# EAGLE design AudioPreAmp-LM741-TO99 (EAGLE 7.2.0)
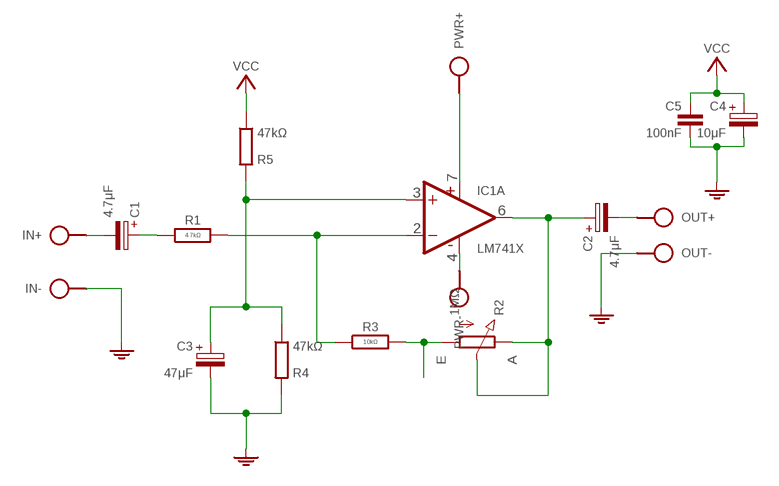
[diagram p0: schematic, sheet 1]

## Parts
C1  4.7μF  CPOLE2,5-4/V  [E2.5-4/V]
C2  4.7μF  CPOLE5-4  [E5-4]
C3  47μF  CPOLE2,5-4  [E2,5-4]
C4  10μF  CPOLE2,5-3  [E2,5-3]
C5  100nF  C050-020X044/V  [C050-020X044/V]
IC1  LM741X  [TO99-X]
IN  SPAD+--+  [SPAD-+]
OUT  SPAD+-+-  [SPAD+-]
PWR+  HPORT  [SPAD]
PWR-  HPORT  [SPAD]
R1  4.7kΩ  R-H0204/10  [0204/10]
R2  1MΩ  POT-3P  [CONN-3P]
R3  10kΩ  R-H0204/10-V  [0204/10-V]
R4  47kΩ  R0204/10-V  [0204/10-V]
R5  47kΩ  R0204/10  [0204/10]

## Nets
AF: C2.- OUT.2
GND: C3.- C4.- C5.2 IN.1 OUT.1 R4.1
IN+: C3.+ IC1.3(A:+IN) R4.2 R5.1
IN-: IC1.2(A:-IN) R1.2 R3.1
N$1: R2.1(A) R3.2
N$2: C1.+ R1.1
N$4: IC1.4(2:V-) PWR-.1
N$7: C1.- IN.2
N$8: C2.+ IC1.6(A:OUT) R2.2(S) R2.3(E)
PWR+: IC1.7(2:V+) PWR+.1
VCC: C4.+ C5.1 R5.2

## Library data of the parts
C1-C4 = c:CPOL: POLARIZED CAPACITOR, European symbol
C5 = c:C: CAPACITOR, European symbol
IC1 = ic:LM741: Operational Amplifier http://www.ti.com/lit/ds/symlink/lm741.pdf
IN OUT = pad:SPAD+-
PWR+ PWR- = pad:HPORT
R1 R3 = r:R-H
R2 = r:POT
R4 R5 = r:R: RESISTOR, European symbol

## Board
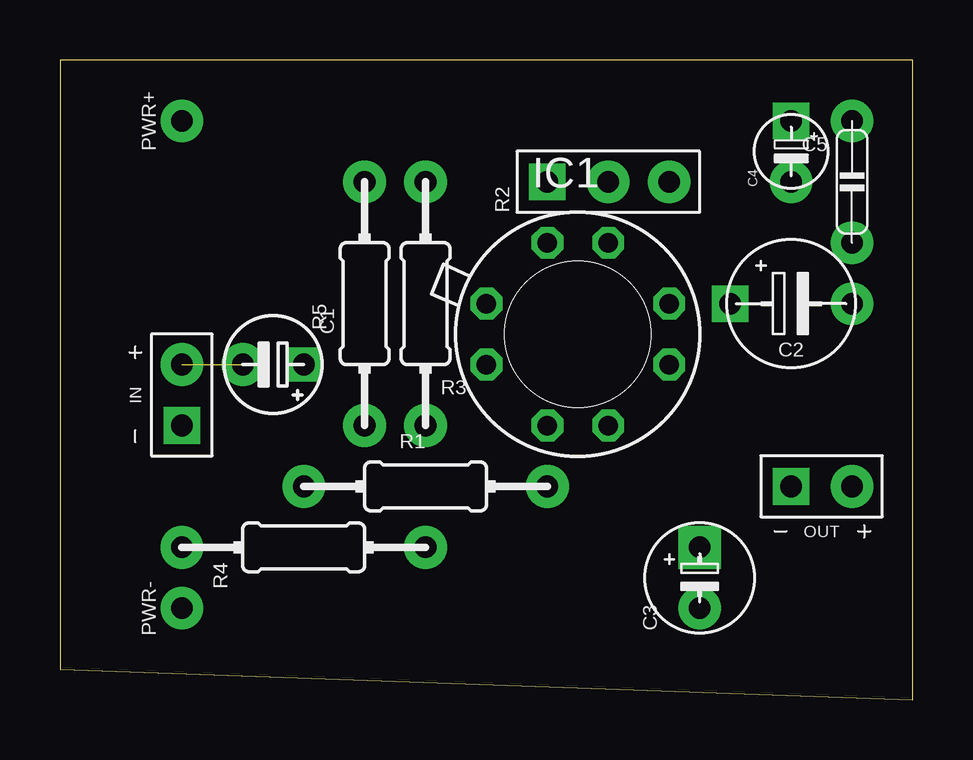
[diagram p1: board, top side]
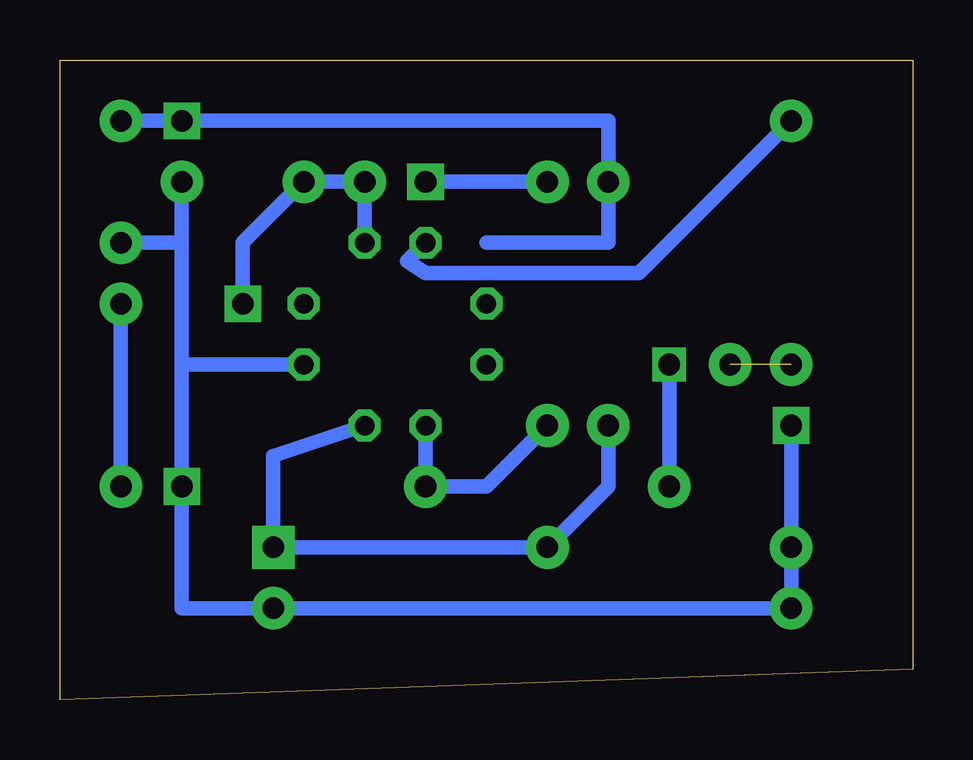
[diagram p2: board, bottom side, seen from below]

Size 35.56 x 26.67 mm. Coordinates in mm from the lower left corner, seen from the top.
Outline: 0,1.27 35.56,0 35.56,26.67 0,26.67 0,1.27
Copper layers (1*16): Top 0.035mm / dielectric 1.5mm / Bottom 0.035mm
Design rules "default": minimum track width 10mil, minimum drill 24mil, track to track 8mil, track to pad 8mil, pad to pad 8mil, via to via 8mil, smd to smd 8mil, copper to edge 40mil, drill to drill 8mil, minimum pad ring 10mil, minimum via ring 8mil, stop-mask expansion 4mil, vias tented up to drill 0mil, thermal gap 10mil

### Footprints (pad centres in the part's own frame; a part is rotated, then mirrored left to right if it is on the bottom)
E2.5-4/V = drill 0.9 square: + 0,1.27 | drill 0.9 pad 1.778: - 0,-1.27
E5-4 = drill 0.9 pad 1.524 square: + -2.54,0 | drill 0.9 pad 1.778: - 2.54,0
E2,5-4 = drill 0.9 pad 1.778 square: + 1.27,0 | drill 0.9 pad 1.778: - -1.27,0
E2,5-3 = drill 0.9 pad 1.524 square: + -1.27,0 | drill 0.9 pad 1.778: - 1.27,0
C050-020X044/V = drill 0.9 pad 1.778: 1 0,2.54; 2 0,-2.54
TO99-X = drill 0.813 pad 1.27 octagon: 1 -2.54,0; 2 0,-2.54; 3 2.54,-2.54; 4 5.08,0; 5 5.08,2.54; 6 2.54,5.08; 7 0,5.08; 8 -2.54,2.54
SPAD-+ = drill 0.9 pad 1.524 square: 1 0,-1.27 | drill 0.9 pad 1.778: 2 0,1.27
SPAD+- = drill 0.9 pad 1.524 square: 1 0,-1.27 | drill 0.9 pad 1.778: 2 0,1.27
SPAD = drill 0.9 pad 1.778: 1 0,0
0204/10 = drill 0.9 pad 1.778: 1 -5.08,0; 2 5.08,0
CONN-3P = drill 0.9 pad 1.524 square: 1 0,2.54 | drill 0.9 pad 1.778: 2 0,0; 3 0,-2.54
0204/10-V = drill 0.9 pad 1.778: 1 0,5.08; 2 0,-5.08

### Placement (x,y rotation side)
C1  8.89,13.97 270 top
C2  30.48,16.51 0 top
C3  26.67,5.08 90 top
C4  30.48,22.86 270 top
C5  33.02,21.59 0 top
IC1  20.32,13.97 0 top
IN  5.08,12.7 0 top
OUT  31.75,8.89 270 top
PWR+  5.08,24.13 0 top
PWR-  5.08,3.81 0 top
R1  15.24,8.89 0 top
R2  22.86,21.59 90 top
R3  15.24,16.51 180 top
R4  10.16,6.35 90 top
R5  12.7,16.51 90 top

### Tracks (layer width: path | path; a pad name or v marks a point on that pad's centre or on a via)
AF
  Bottom 0.61: OUT.2 C2.-
GND
  Bottom 0.61: IN.1 R4.1 5.08,3.81 C3.- 30.48,3.81 OUT.1 30.48,19.05 | 30.48,19.05 C4.- | 30.48,19.05 C5.2
IN+
  Bottom 0.61: R5.1 12.7,8.89 R4.2 C3.+ 26.67,10.16 IC1.3
IN-
  Bottom 0.61: IC1.2 R1.2 17.78,8.89 R3.1
N$1
  Bottom 0.61: R3.2 R2.1
N$2
  Bottom 0.61: C1.+ R1.1
N$4
  Bottom 0.61: IC1.4 30.48,13.97 30.48,3.81 PWR-.1
N$7  (1 unrouted)
N$8
  Bottom 0.61: C2.+ 27.94,19.05 R2.3 R2.2 IC1.6
PWR+
  Bottom 0.61: PWR+.1 11.43,17.78 20.32,17.78 21.08,18.29 IC1.7
VCC
  Bottom 0.61: 17.78,19.05 12.7,19.05 R5.2 12.7,24.13 C4.+ C5.1